# Altium schematic sheet YTN1-E608(Key)按键板..schdoc
size A4; SheetNumber: 0; SheetTotal: 0
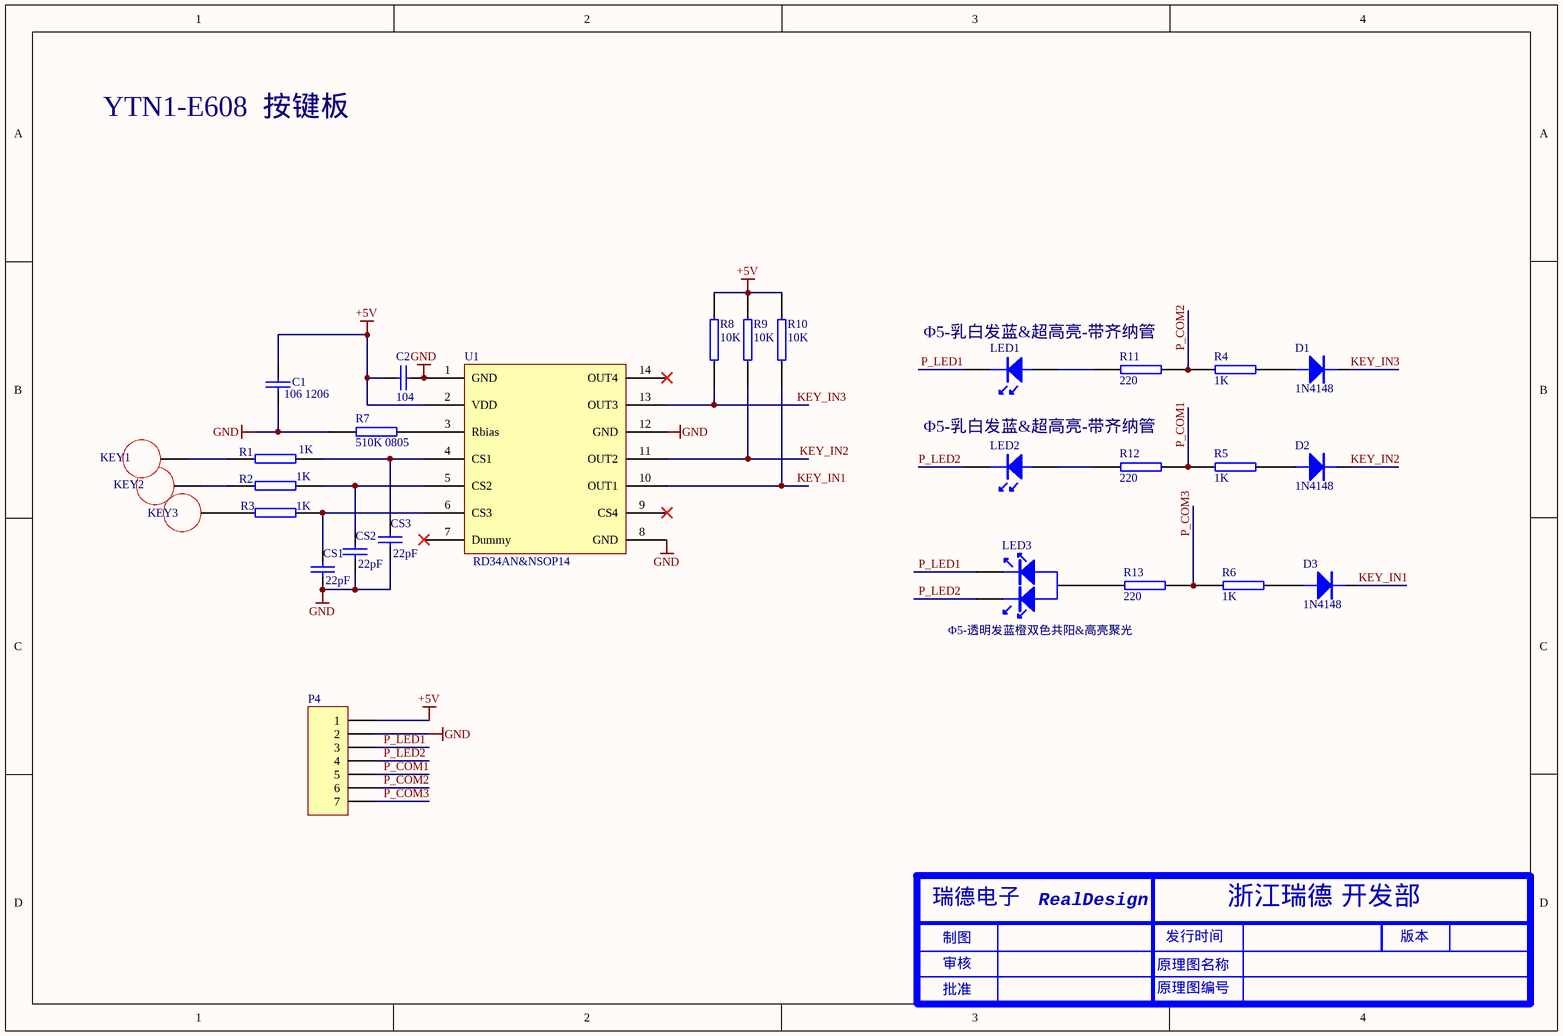
[diagram p0: YTN1-E608(Key)按键板..schdoc]

## Parts
C1  106 1206
C2  104
CS1  22pF
CS2  22pF
CS3  22pF
D1  1N4148
D2  1N4148
D3  1N4148
KEY1  (no value)  [7130A-K]
KEY2  (no value)  [7130A-K]
KEY3  (no value)  [7130A-K]
LED1  (no value)  [LED5.0-AI1]
LED2  (no value)  [LED5.0-AI1]
LED3  Φ5-透明发蓝橙双色共阳&高亮聚光
P4  (no value)  [HDR1X7]
R1  1K
R2  1K
R3  1K
R4  1K
R5  1K
R6  1K
R7  510K 0805
R8  10K
R9  10K
R10  10K
R11  220
R12  220
R13  220
U1  RD34AN&NSOP14  [SOP14]

## Nets
+5V: C1.1 C2.2 P4.1 R8.2 R9.2 R10.2 U1.2(VDD)
GND: C1.2 C2.1 CS1.2 CS2.2 CS3.2 P4.2 R7.1 U1.1(GND) U1.8(GND) U1.12(GND)
KEY_IN1: D3.K R10.1 U1.10(OUT1)
KEY_IN2: D2.K R9.1 U1.11(OUT2)
KEY_IN3: D1.K R8.1 U1.13(OUT3)
P_COM1: P4.5 R5.1 R12.1
P_COM2: P4.6 R4.1 R11.1
P_COM3: P4.7 R6.1 R13.1
P_LED1: LED1.K LED3.K P4.3
P_LED2: LED2.K LED3.K P4.4
NetCS1_1: CS1.1 R3.2 U1.6(CS3)
NetCS2_1: CS2.1 R2.2 U1.5(CS2)
NetCS3_1: CS3.1 R1.2 U1.4(CS1)
NetD1_A: D1.A R4.2
NetD2_A: D2.A R5.2
NetD3_A: D3.A R6.2
NetKEY1_1: KEY1.1 R1.1
NetKEY2_1: KEY2.1 R2.1
NetKEY3_1: KEY3.1 R3.1
NetLED1_A: LED1.A R11.2
NetLED2_A: LED2.A R12.2
NetLED3_0: LED3.0 R13.2
NetR7_2: R7.2 U1.3(Rbias)

Not connected (* = marked no-connect by the designer): U1 7(Dummy)* 9(CS4)* 14(OUT4)*

## Notes on the sheet
- YTN1-E608  按键板
- (near LED1) Φ5-乳白发蓝&超高亮-带齐纳管
- Φ5-乳白发蓝&超高亮-带齐纳管
- 瑞德电子
- RealDesign
- 浙江瑞德 开发部
- 制图
- 审核
- 原理图名称
- 发行时间
- 版本
- 批准
- 原理图编号

## Library data of the parts
C1 C2 CS1-CS3 = CAP
D1-D3 = D4007
KEY1-KEY3 = TPAD-2
LED1 LED2 = LED
LED3 = 共阳双色发光二极管
P4 = Header 7: Header, 7-Pin; LatestRevisionDate: 17-Jul-2002; LatestRevisionNote: Re-released for DXP Platform.; Publisher: Altium Limited
R1-R10 R13 = R
R11 R12 = RES2
U1 = HT48R06A-1(16PIN)